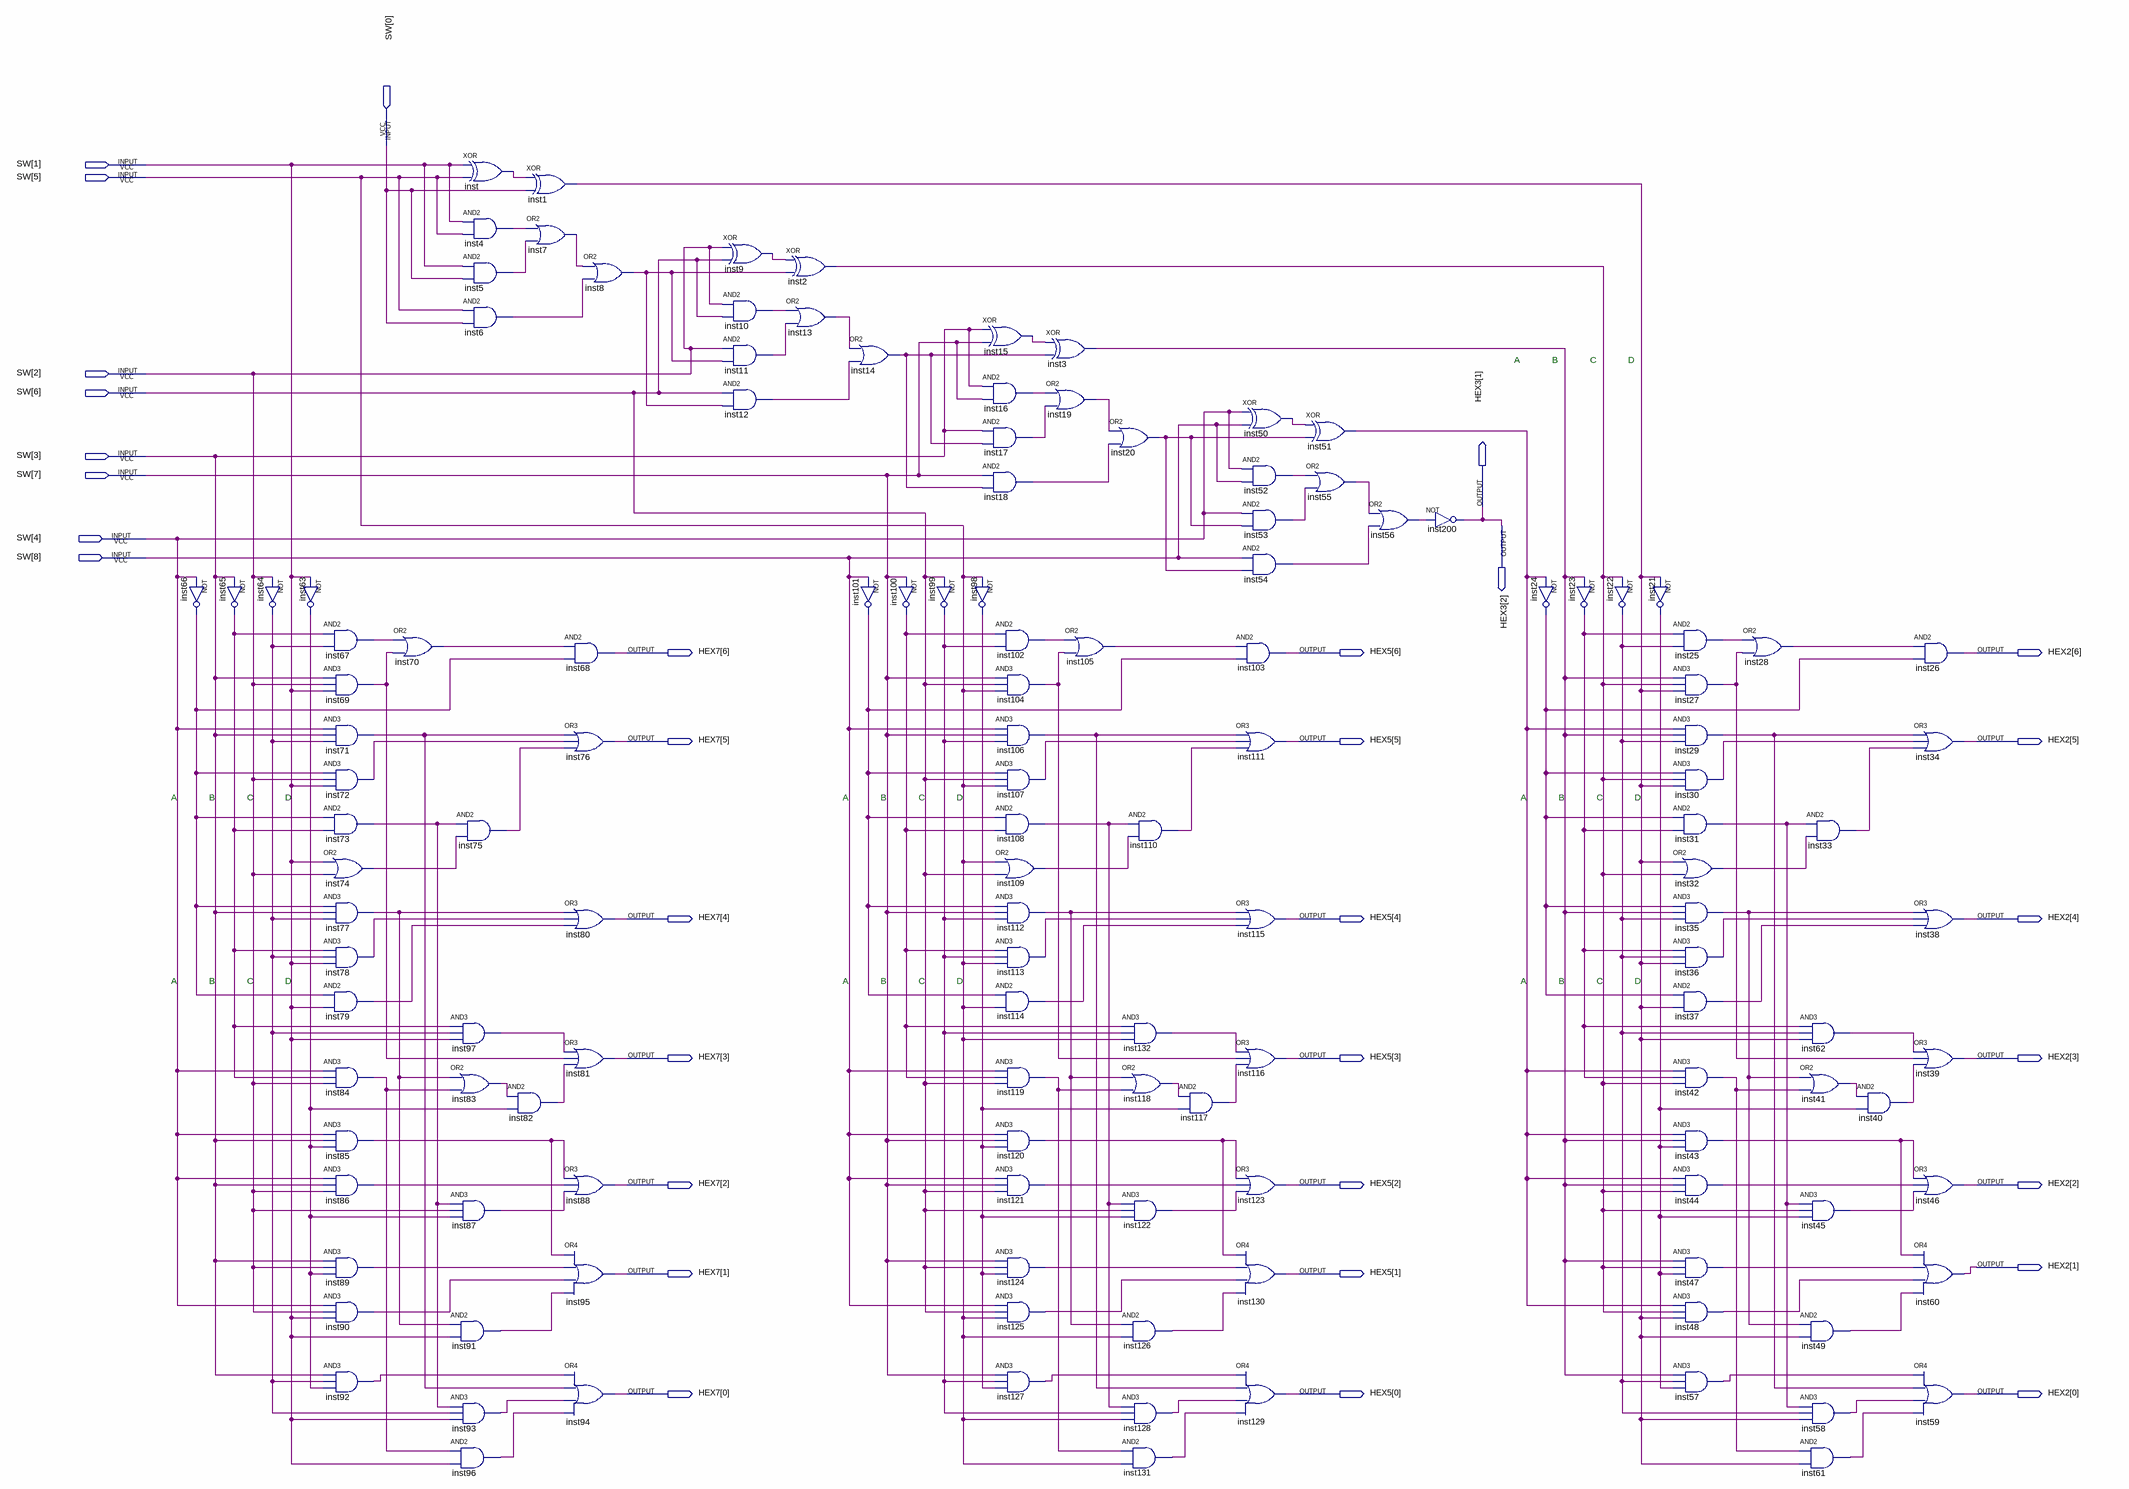
[diagram p0: schematic sheet]
// Quartus schematic AdderWithDisplay.bdf as structural Verilog: 134 symbols, 32 pins
module AdderWithDisplay (
  input  [8:0] SW,
  output [2:1] HEX3,
  output [6:0] HEX7,
  output [6:0] HEX5,
  output [6:0] HEX2
);

  wire inst1_out, inst2_out, inst3_out, inst4_out, inst5_out, inst6_out, inst7_out, inst8_out, inst9_out,
       inst10_out, inst11_out, inst12_out, inst13_out, inst14_out, inst15_out, inst16_out, inst17_out,
       inst18_out, inst19_out, inst20_out, inst21_out, inst22_out, inst23_out, inst24_out, inst25_out,
       inst27_out, inst28_out, inst29_out, inst30_out, inst31_out, inst32_out, inst33_out, inst35_out,
       inst36_out, inst37_out, inst40_out, inst41_out, inst42_out, inst43_out, inst44_out, inst45_out,
       inst47_out, inst48_out, inst49_out, inst50_out, inst51_out, inst52_out, inst53_out, inst54_out,
       inst55_out, inst56_out, inst57_out, inst58_out, inst61_out, inst62_out, inst63_out, inst64_out,
       inst65_out, inst66_out, inst67_out, inst69_out, inst70_out, inst71_out, inst72_out, inst73_out,
       inst74_out, inst75_out, inst77_out, inst78_out, inst79_out, inst82_out, inst83_out, inst84_out,
       inst85_out, inst86_out, inst87_out, inst89_out, inst90_out, inst91_out, inst92_out, inst93_out,
       inst96_out, inst97_out, inst98_out, inst99_out, inst100_out, inst101_out, inst102_out, inst104_out,
       inst105_out, inst106_out, inst107_out, inst108_out, inst109_out, inst110_out, inst112_out,
       inst113_out, inst114_out, inst117_out, inst118_out, inst119_out, inst120_out, inst121_out,
       inst122_out, inst124_out, inst125_out, inst126_out, inst127_out, inst128_out, inst131_out,
       inst132_out, inst_out;

  not inst66 (inst66_out, SW[4]);
  not inst65 (inst65_out, SW[3]);
  not inst64 (inst64_out, SW[2]);
  not inst63 (inst63_out, SW[1]);
  and inst67 (inst67_out, inst65_out, inst64_out);
  and inst69 (inst69_out, SW[3], SW[2], SW[1]);
  and inst71 (inst71_out, SW[4], SW[3], inst64_out);
  and inst72 (inst72_out, inst66_out, SW[2], SW[1]);
  and inst73 (inst73_out, inst66_out, inst65_out);
  or inst74 (inst74_out, SW[1], SW[2]);
  and inst77 (inst77_out, inst66_out, SW[3], inst64_out);
  and inst78 (inst78_out, inst65_out, inst64_out, SW[1]);
  and inst79 (inst79_out, inst66_out, SW[1]);
  and inst84 (inst84_out, SW[4], inst65_out, SW[2]);
  and inst85 (inst85_out, SW[4], SW[3], inst63_out);
  and inst86 (inst86_out, SW[4], SW[3], SW[2]);
  and inst89 (inst89_out, SW[3], SW[2], inst63_out);
  and inst90 (inst90_out, SW[4], SW[2], SW[1]);
  and inst92 (inst92_out, SW[3], inst64_out, inst63_out);
  or inst70 (inst70_out, inst67_out, inst69_out);
  xor inst (inst_out, SW[1], SW[5]);
  and inst4 (inst4_out, SW[1], SW[5]);
  and inst5 (inst5_out, SW[1], SW[0]);
  and inst6 (inst6_out, SW[5], SW[0]);
  and inst75 (inst75_out, inst73_out, inst74_out);
  and inst97 (inst97_out, inst65_out, inst64_out, SW[1]);
  or inst83 (inst83_out, inst77_out, inst84_out);
  and inst87 (inst87_out, inst73_out, SW[2], inst63_out);
  and inst91 (inst91_out, inst77_out, SW[1]);
  and inst93 (inst93_out, inst73_out, inst64_out, SW[1]);
  and inst96 (inst96_out, inst84_out, SW[1]);
  xor inst1 (inst1_out, inst_out, SW[0]);
  or inst7 (inst7_out, inst4_out, inst5_out);
  and inst82 (inst82_out, inst83_out, inst63_out);
  or inst8 (inst8_out, inst7_out, inst6_out);
  and inst68 (HEX7[6], inst70_out, inst66_out);
  or inst76 (HEX7[5], inst71_out, inst72_out, inst75_out);
  or inst80 (HEX7[4], inst77_out, inst78_out, inst79_out);
  or inst81 (HEX7[3], inst97_out, inst69_out, inst82_out);
  or inst88 (HEX7[2], inst85_out, inst86_out, inst87_out);
  or inst95 (HEX7[1], inst85_out, inst89_out, inst90_out, inst91_out);
  or inst94 (HEX7[0], inst92_out, inst71_out, inst93_out, inst96_out);
  xor inst9 (inst9_out, SW[2], SW[6]);
  and inst10 (inst10_out, SW[2], SW[6]);
  and inst11 (inst11_out, SW[2], inst8_out);
  and inst12 (inst12_out, SW[6], inst8_out);
  xor inst2 (inst2_out, inst9_out, inst8_out);
  or inst13 (inst13_out, inst10_out, inst11_out);
  or inst14 (inst14_out, inst13_out, inst12_out);
  not inst100 (inst100_out, SW[7]);
  not inst101 (inst101_out, SW[8]);
  not inst99 (inst99_out, SW[6]);
  xor inst15 (inst15_out, SW[3], SW[7]);
  and inst16 (inst16_out, SW[3], SW[7]);
  and inst17 (inst17_out, SW[3], inst14_out);
  and inst18 (inst18_out, SW[7], inst14_out);
  not inst98 (inst98_out, SW[5]);
  and inst102 (inst102_out, inst100_out, inst99_out);
  and inst104 (inst104_out, SW[7], SW[6], SW[5]);
  and inst106 (inst106_out, SW[8], SW[7], inst99_out);
  and inst107 (inst107_out, inst101_out, SW[6], SW[5]);
  and inst108 (inst108_out, inst101_out, inst100_out);
  or inst109 (inst109_out, SW[5], SW[6]);
  and inst112 (inst112_out, inst101_out, SW[7], inst99_out);
  and inst113 (inst113_out, inst100_out, inst99_out, SW[5]);
  and inst114 (inst114_out, inst101_out, SW[5]);
  and inst119 (inst119_out, SW[8], inst100_out, SW[6]);
  and inst120 (inst120_out, SW[8], SW[7], inst98_out);
  and inst121 (inst121_out, SW[8], SW[7], SW[6]);
  and inst124 (inst124_out, SW[7], SW[6], inst98_out);
  and inst125 (inst125_out, SW[8], SW[6], SW[5]);
  and inst127 (inst127_out, SW[7], inst99_out, inst98_out);
  xor inst3 (inst3_out, inst15_out, inst14_out);
  or inst19 (inst19_out, inst16_out, inst17_out);
  or inst105 (inst105_out, inst102_out, inst104_out);
  or inst20 (inst20_out, inst19_out, inst18_out);
  and inst110 (inst110_out, inst108_out, inst109_out);
  and inst132 (inst132_out, inst100_out, inst99_out, SW[5]);
  or inst118 (inst118_out, inst112_out, inst119_out);
  and inst122 (inst122_out, inst108_out, SW[6], inst98_out);
  and inst126 (inst126_out, inst112_out, SW[5]);
  and inst128 (inst128_out, inst108_out, inst99_out, SW[5]);
  and inst131 (inst131_out, inst119_out, SW[5]);
  and inst117 (inst117_out, inst118_out, inst98_out);
  xor inst50 (inst50_out, SW[4], SW[8]);
  and inst52 (inst52_out, SW[4], SW[8]);
  and inst53 (inst53_out, SW[4], inst20_out);
  and inst54 (inst54_out, SW[8], inst20_out);
  and inst103 (HEX5[6], inst105_out, inst101_out);
  or inst111 (HEX5[5], inst106_out, inst107_out, inst110_out);
  or inst115 (HEX5[4], inst112_out, inst113_out, inst114_out);
  or inst116 (HEX5[3], inst132_out, inst104_out, inst117_out);
  or inst123 (HEX5[2], inst120_out, inst121_out, inst122_out);
  or inst130 (HEX5[1], inst120_out, inst124_out, inst125_out, inst126_out);
  or inst129 (HEX5[0], inst127_out, inst106_out, inst128_out, inst131_out);
  xor inst51 (inst51_out, inst50_out, inst20_out);
  or inst55 (inst55_out, inst52_out, inst53_out);
  or inst56 (inst56_out, inst55_out, inst54_out);
  not inst200 (HEX3[2], inst56_out);
  not inst24 (inst24_out, inst51_out);
  not inst23 (inst23_out, inst3_out);
  not inst21 (inst21_out, inst1_out);
  not inst22 (inst22_out, inst2_out);
  and inst25 (inst25_out, inst23_out, inst22_out);
  and inst27 (inst27_out, inst3_out, inst2_out, inst1_out);
  and inst29 (inst29_out, inst51_out, inst3_out, inst22_out);
  and inst30 (inst30_out, inst24_out, inst2_out, inst1_out);
  and inst31 (inst31_out, inst24_out, inst23_out);
  or inst32 (inst32_out, inst1_out, inst2_out);
  and inst35 (inst35_out, inst24_out, inst3_out, inst22_out);
  and inst36 (inst36_out, inst23_out, inst22_out, inst1_out);
  and inst37 (inst37_out, inst24_out, inst1_out);
  and inst42 (inst42_out, inst51_out, inst23_out, inst2_out);
  and inst43 (inst43_out, inst51_out, inst3_out, inst21_out);
  and inst44 (inst44_out, inst51_out, inst3_out, inst2_out);
  and inst47 (inst47_out, inst3_out, inst2_out, inst21_out);
  and inst48 (inst48_out, inst51_out, inst2_out, inst1_out);
  and inst57 (inst57_out, inst3_out, inst22_out, inst21_out);
  or inst28 (inst28_out, inst25_out, inst27_out);
  and inst33 (inst33_out, inst31_out, inst32_out);
  and inst62 (inst62_out, inst23_out, inst22_out, inst1_out);
  or inst41 (inst41_out, inst35_out, inst42_out);
  and inst45 (inst45_out, inst31_out, inst2_out, inst21_out);
  and inst49 (inst49_out, inst35_out, inst1_out);
  and inst58 (inst58_out, inst31_out, inst22_out, inst1_out);
  and inst61 (inst61_out, inst42_out, inst1_out);
  and inst40 (inst40_out, inst41_out, inst21_out);
  and inst26 (HEX2[6], inst28_out, inst24_out);
  or inst34 (HEX2[5], inst29_out, inst30_out, inst33_out);
  or inst38 (HEX2[4], inst35_out, inst36_out, inst37_out);
  or inst39 (HEX2[3], inst62_out, inst27_out, inst40_out);
  or inst46 (HEX2[2], inst43_out, inst44_out, inst45_out);
  or inst60 (HEX2[1], inst43_out, inst47_out, inst48_out, inst49_out);
  or inst59 (HEX2[0], inst57_out, inst29_out, inst58_out, inst61_out);

  assign HEX3[1] = HEX3[2];

  // Notes on the sheet:
  //   A
  //   B
  //   C
  //   D
  //   A
  //   B
  //   C
  //   D
  //   A
  //   B
  //   C
  //   D
  //   A
  //   B
  //   C
  //   D
  //   A
  //   B
  //   C
  //   D
  //   A
  //   B
  //   C
  //   D
  //   A
  //   B
  //   C
  //   D
endmodule
